# Altium schematic sheet Sorting_servo.SchDoc
size A
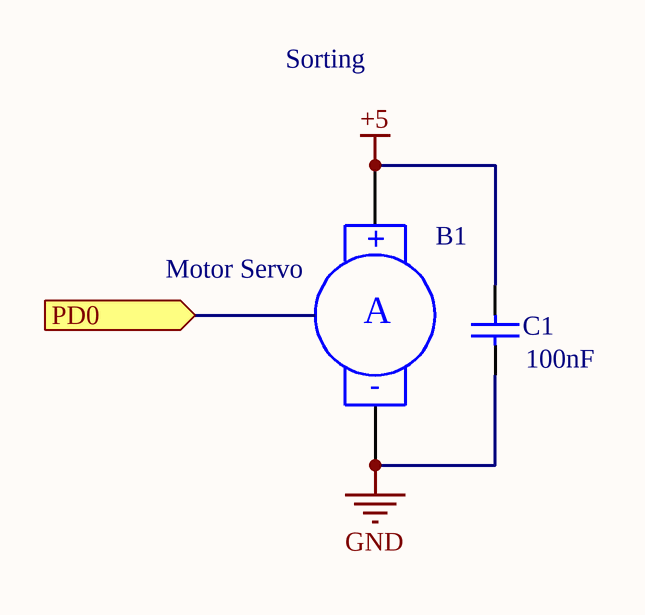
[diagram p0: Sorting_servo.SchDoc]

## Parts
B1  Motor Servo  [RAD-0.4]
C1  value 100nF  [RAD-0.3]  (hidden comment: Cap)

## Ports
PD0 (in)

## Nets
+5: B1.1(+) C1.2
GND: B1.2(-) C1.1

## Notes on the sheet
- Sorting
- (in symbol Motor Servo) A

## Library data of the parts
B1 = Motor Servo: Servo Motor; Published: 24-Mar-1999; LatestRevisionDate: 17-Jul-2002; LatestRevisionNote: Re-released for DXP Platform.; PackageReference: RAD-0.4; Publisher: Altium Limited; PackageDescription: Radial Cap, Thru-Hole; 2 Leads; 0.4 in Pin Spacing
C1 = Cap: Capacitor; Published: 8-Jun-2000; LatestRevisionDate: 17-Jul-2002; LatestRevisionNote: Re-released for DXP Platform.; PackageReference: RAD-0.3; Publisher: Altium Limited; PackageDescription: Radial Cap, Thru-Hole; 2 Leads; 0.3 in Pin Spacing